# Altium schematic sheet STM8_FootPrint.schdoc
size A4
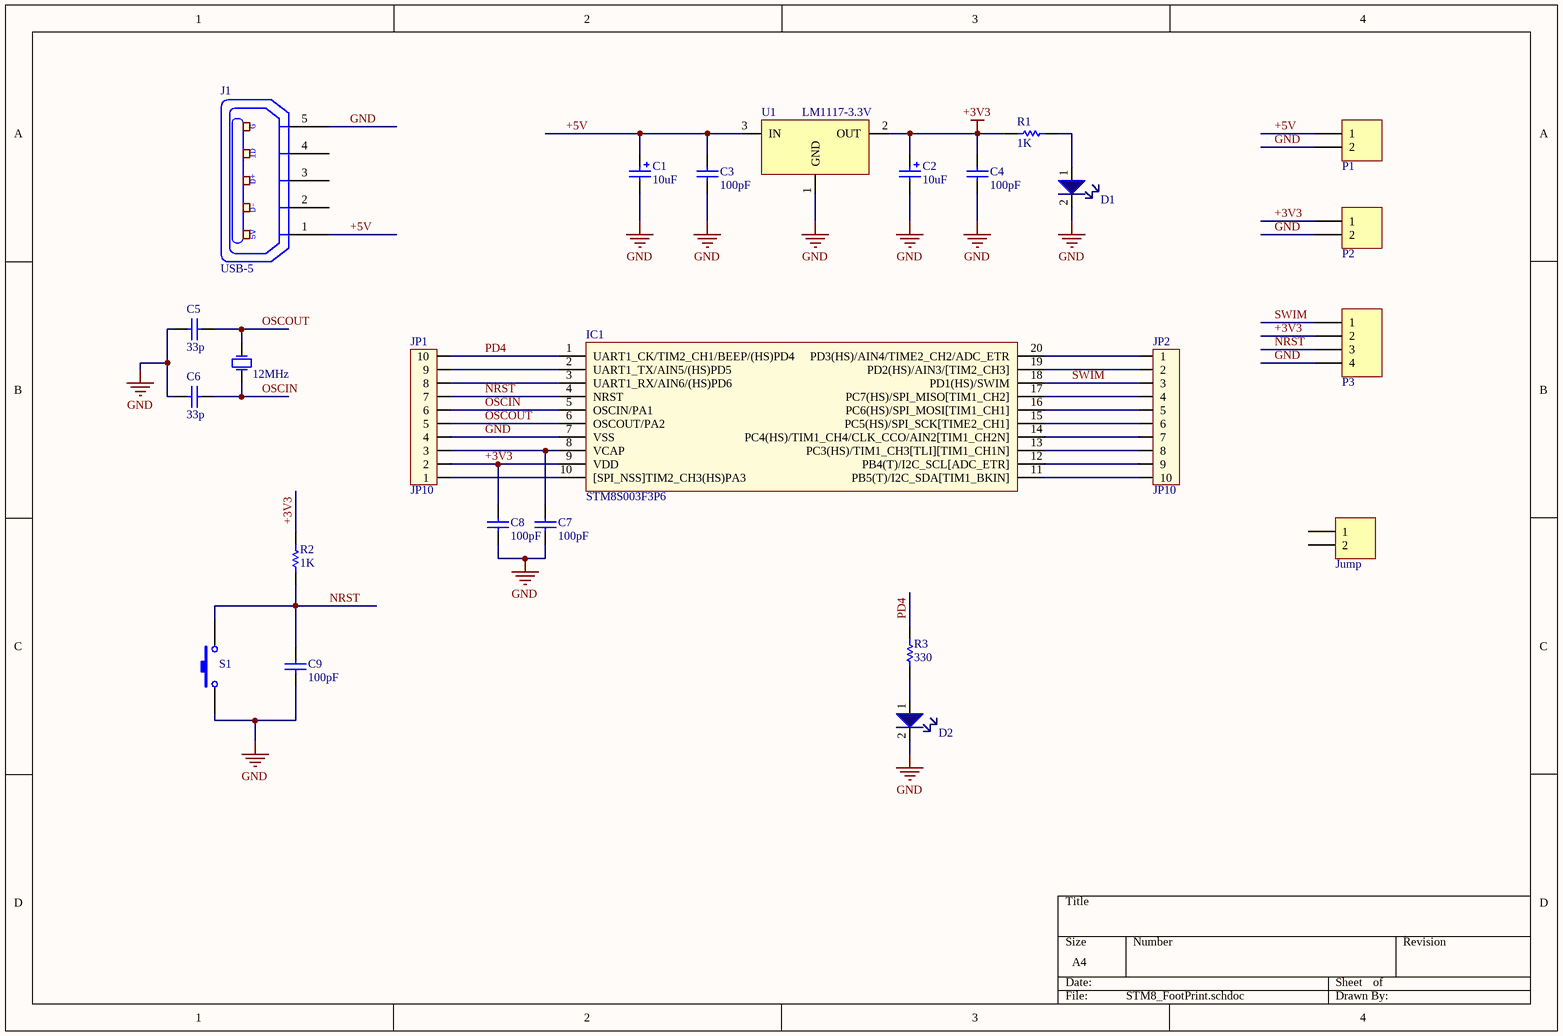
[diagram p0: STM8_FootPrint.schdoc]

## Parts
C1  value 10uF  [CP1/2]  (hidden comment: Cap Pol)
C2  value 10uF  [CP1/2]  (hidden comment: Cap Pol)
C3  value 100pF  [CAP-SM-0805]  (hidden comment: Cap Non-Pol SMD)
C4  value 100pF  [CAP-SM-0805]  (hidden comment: Cap Non-Pol SMD)
C5  value 33p  [Tu-ceramic]  (hidden comment: Capacitor Ceramic)
C6  value 33p  [Tu-ceramic]  (hidden comment: Capacitor Ceramic)
C7  value 100pF  [CAP-SM-0805]  (hidden comment: Cap Non-Pol SMD)
C8  value 100pF  [CAP-SM-0805]  (hidden comment: Cap Non-Pol SMD)
C9  value 100pF  [CAP-SM-0805]  (hidden comment: Cap Non-Pol SMD)
D1  LED  [LED 3mm]  (value not drawn)
D2  LED  [LED 3mm]  (value not drawn)
IC1  STM8S003F3P6  [TSSOP20]
J1  USB-5  [USB-M2]
JP1  JP10  [Header10]
JP2  JP10  [Header10]
Jump  Header 2  [JP2]  (value not drawn)
P1  Header 2  [JP2]  (value not drawn)
P2  Header 2  [JP2]  (value not drawn)
P3  Header 4  [JP4]  (value not drawn)
R1  value 1K  [RES-SM-0805]  (hidden comment: RESISTOR SMD)
R2  value 1K  [RES-SM-0805]  (hidden comment: RESISTOR SMD)
R3  value 330  [RES-SM-0805]  (hidden comment: RESISTOR SMD)
S1  Tact SW - 2Pin  [SW2]  (value not drawn)
U1  LM1117-3.3V  [SOT223]
Y1  12MHz  [XTAL]

## Nets
+3V3: C2.1 C4.1 C8.1 IC1.9(VDD) JP1.2 P2.1 P3.2 R1.1 R2.2 U1.2(OUT)
GND: C1.2 C2.2 C3.2 C4.2 C5.1 C6.1 C7.2 C8.2 C9.2 D1.2 D2.2 IC1.7(VSS) J1.5(P5) JP1.4 P1.2 P2.2 P3.4 S1.1 U1.1(GND)
+5V: C1.1 C3.1 J1.1(P1) P1.1 U1.3(IN)
NRST: C9.1 IC1.4(NRST) JP1.7 P3.3 R2.1 S1.2
OSCIN: C6.2 IC1.5(OSCIN/PA1) JP1.6 Y1.2(OSC2)
OSCOUT: C5.2 IC1.6(OSCOUT/PA2) JP1.5 Y1.1(OSC1)
PD4: IC1.1(UART1_CK/TIM2_CH1/BEEP/(HS)PD4) JP1.10 R3.2
SWIM: IC1.18(PD1(HS)/SWIM) JP2.3 P3.1
NetC7_1: C7.1 IC1.8(VCAP) JP1.3
NetD1_1: D1.1 R1.2
NetD2_1: D2.1 R3.1
NetIC1_2: IC1.2(UART1_TX/AIN5/(HS)PD5) JP1.9
NetIC1_3: IC1.3(UART1_RX/AIN6/(HS)PD6) JP1.8
NetIC1_10: IC1.10([SPI_NSS]TIM2_CH3(HS)PA3) JP1.1
NetIC1_11: IC1.11(PB5(T)/I2C_SDA[TIM1_BKIN]) JP2.10
NetIC1_12: IC1.12(PB4(T)/I2C_SCL[ADC_ETR]) JP2.9
NetIC1_13: IC1.13(PC3(HS)/TIM1_CH3[TLI][TIM1_CH1N]) JP2.8
NetIC1_14: IC1.14(PC4(HS)/TIM1_CH4/CLK_CCO/AIN2[TIM1_CH2N]) JP2.7
NetIC1_15: IC1.15(PC5(HS)/SPI_SCK[TIME2_CH1]) JP2.6
NetIC1_16: IC1.16(PC6(HS)/SPI_MOSI[TIM1_CH1]) JP2.5
NetIC1_17: IC1.17(PC7(HS)/SPI_MISO[TIM1_CH2]) JP2.4
NetIC1_19: IC1.19(PD2(HS)/AIN3/[TIM2_CH3]) JP2.2
NetIC1_20: IC1.20(PD3(HS)/AIN4/TIME2_CH2/ADC_ETR) JP2.1

Not connected (* = marked no-connect by the designer): J1 2(P2) 3(P3) 4(P4); Jump 1 2

## Notes on the sheet
- (in symbol USB-5) G; ID; D+; D-; 5V

## Library data of the parts
C1 C2 = Cap Pol: Polarized Capacitor (Radial)
C3 C4 C7-C9 = Cap Non-Pol SMD: Capacitor
C5 C6 = CapDecop: Capacitor; Published: 8-Jun-2000; LatestRevisionDate: 17-Jul-2002; LatestRevisionNote: Re-released for DXP Platform.; PackageReference: RAD-0.3; Publisher: Altium Limited
IC1 = STM8S003F3P6: MCU 8BIT  8KB FLASH TSSOP-20; Value: 24Cxx; Value: DIP 8; Copyright by: VanDungEvn
J1 = USB-5: Manufacturer: FCI; Manufacturer Part Number: 10118193-0001LF; Connector Type: USB - micro B; Number of Contacts: 5; Gender: Receptacle; Specifications: USB 2.0; .Creator: MM; .Checked PCB: RF; Supplier 1: Digi-Key; RoHS: RoHS Compliant; Category: Connectors, Interconnects; Stock 1: 28642; Pricing 1: 1=0.46, 10=0.433, 25=0.3712, 50=0.3156, 100=0.3032, 250=0.27224, 500=0.25988 (USD); Packaging: Cut Tape (CT); Mounting Type: Surface Mount, Right Angle, Horizontal; Features: Shielded, Solder Retention; Ingress Protection: -; ComponentLink1URL: http://portal.fciconnect.com/Comergent//fci/drawing/10118193.pdf; ComponentLink1Description: http://portal.fciconnect.com/Comergent//fci/drawing/10118193.pdf; Supplier Part Number 1: 609-4616-1-ND; .Checked SCH: MM
JP1 JP2 = Header10: Connector 10; Value: Connector 10
Jump P1 P2 = Header 2: Header, 2-Pin; LatestRevisionDate: 17-Jul-2002; LatestRevisionNote: Re-released for DXP Platform.; Publisher: Altium Limited
P3 = Header 4: Header, 4-Pin; LatestRevisionDate: 17-Jul-2002; LatestRevisionNote: Re-released for DXP Platform.; Publisher: Altium Limited
R1-R3 = RESISTOR SMD: Resistor
S1 = Tact SW - 2Pin: Switch button 2 pin
U1 = LM1117: 800mA Low-Dropout Linear Regulator; Creator: Nguyen Ba Bien; Website: http://group3i.net
Y1 = XTAL: Crystal Oscillator; Published: 8-Jun-2000; LatestRevisionDate: 17-Jul-2002; LatestRevisionNote: Re-released for DXP Platform.; PackageReference: R38; Publisher: Altium Limited